# Altium schematic sheet STM32F405.SchDoc
size 317 x 241 mm
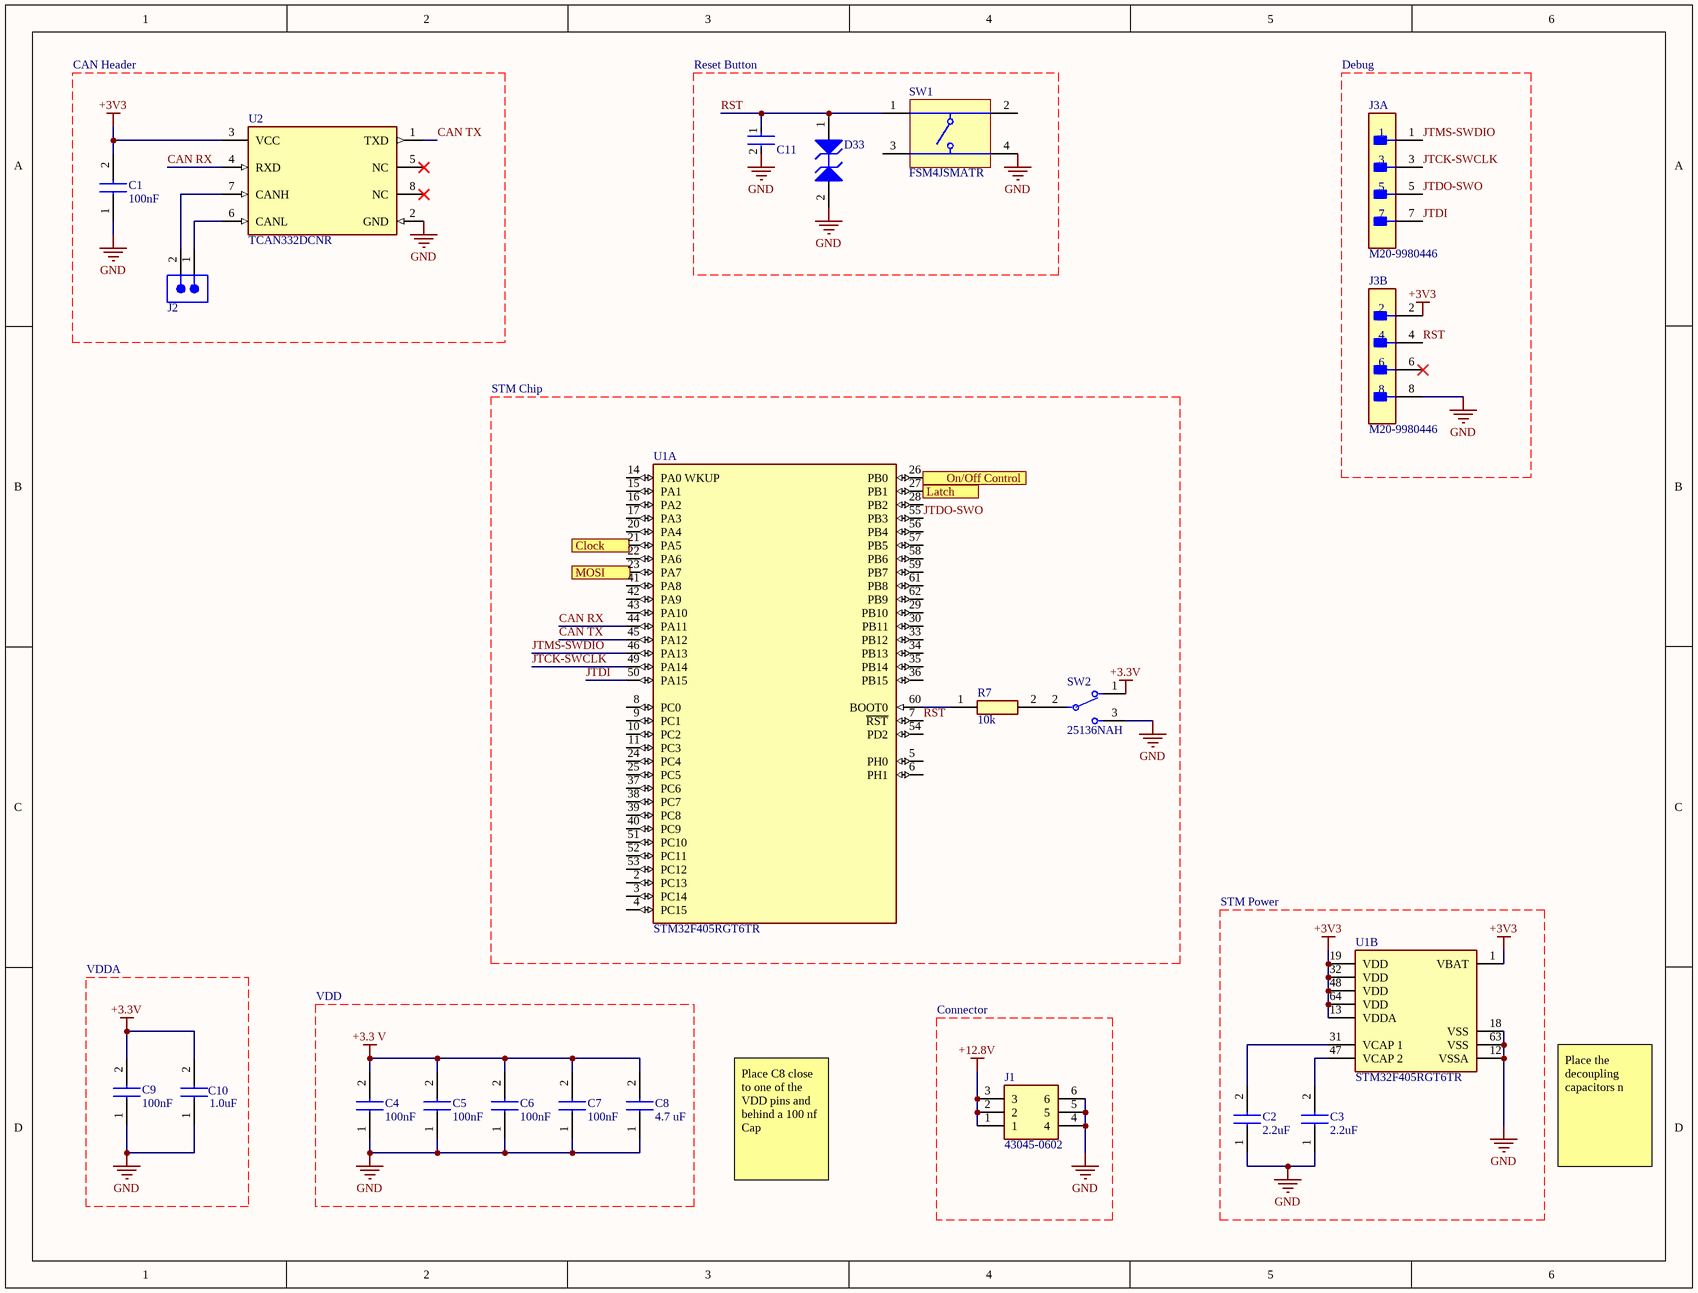
[diagram p0: STM32F405.SchDoc]

## Parts
C1  100nF  [C1206]
C2  2.2uF  [CAPC2012X145N]
C3  2.2uF  [CAPC2012X145N]
C4  100nF  [C1206]
C5  100nF  [C1206]
C6  100nF  [C1206]
C7  100nF  [C1206]
C8  4.7 uF  [C1210]
C9  100nF  [CAPC3216X95N]
C10  1.0uF  [C0805]
C11  100 nF  [FP-CL31-IPC_C]  (value not drawn)
D33  ESD5B5.0ST1G  [ONSC-SOD-523-2-502-01_C_V]  (value not drawn)
J1  43045-0602  [43045-06(00,01,02,10)]
J2  679302124022  [679302124022]  (value not drawn)
J3  M20-9980446  [FP-M20-9980446-MFG]  (parts A,B of 2)
R7  10k  [RESC3016X65N]
SW1  FSM4JSMATR  [TECO-FSM4JSMATR_V]
SW2  25136NAH  [FP-25136NAH-MFG]
U1  STM32F405RGT6TR  [FP-LQFP64-5W-IPC_C]  (parts A,B of 2)
U2  TCAN332DCNR  [FP-DCN0008A-IPC_A]

## Ports
Clock (out), Latch (out), MOSI (out), On/Off Control (out)

## Nets
+3.3 V: C4.2 C5.2 C6.2 C7.2 C8.2
+3.3V: C9.2 C10.2 SW2.1
+3V3: C1.2 J3.2 U1.1(VBAT) U1.13(VDDA) U1.19(VDD) U1.32(VDD) U1.48(VDD) U1.64(VDD) U2.3(VCC)
+12.8V: J1.1 J1.2 J1.3
GND: C1.1 C2.1 C3.1 C4.1 C5.1 C6.1 C7.1 C8.1 C9.1 C10.1 C11.2 D33.2(A2) J1.4 J1.5 J1.6 J3.8 SW1.4 SW2.3 U1.12(VSSA) U1.18(VSS) U1.63(VSS) U2.2(GND)
CAN RX: U1.44(PA11) U2.4(RXD)
CAN TX: U1.45(PA12) U2.1(TXD)
JTCK-SWCLK: J3.3 U1.49(PA14)
JTDI: J3.7 U1.50(PA15)
JTDO-SWO: J3.5 U1.55(PB3)
JTMS-SWDIO: J3.1 U1.46(PA13)
Latch: U1.27(PB1) ; port Latch
On/Off Control: U1.26(PB0) ; port On/Off Control
RST: C11.1 D33.1(A1) J3.4 SW1.1 U1.7(~{RST})
NetC2_2: C2.2 U1.31(VCAP_1)
NetC3_2: C3.2 U1.47(VCAP_2)
NetJ2_1: J2.1 U2.6(CANL)
NetJ2_2: J2.2 U2.7(CANH)
NetR7_1: R7.1 U1.60(BOOT0)
NetR7_2: R7.2 SW2.2

Not connected (* = marked no-connect by the designer): J3 6*; SW1 2 3; U1 2(PC13) 3(PC14) 4(PC15) 5(PH0) 6(PH1) 8(PC0) 9(PC1) 10(PC2) 11(PC3) 14(PA0_WKUP) 15(PA1) 16(PA2) 17(PA3) 20(PA4) 21(PA5) 22(PA6) 23(PA7) 24(PC4) 25(PC5) 28(PB2) 29(PB10) 30(PB11) 33(PB12) 34(PB13) 35(PB14) 36(PB15) 37(PC6) 38(PC7) 39(PC8) 40(PC9) 41(PA8) 42(PA9) 43(PA10) 51(PC10) 52(PC11) 53(PC12) 54(PD2) 56(PB4) 57(PB5) 58(PB6) 59(PB7) 61(PB8) 62(PB9); U2 5(NC)* 8(NC)*

## Notes on the sheet
- CAN Header
- Reset Button
- Debug
- STM Chip
- STM Power
- VDDA
- VDD
- Connector
- Place C8 close to one of the VDD pins and behind a 100 nf Cap
- Place the decoupling capacitors n

## Library data of the parts
C1 C4-C7 = C1206C104K5RACTU: Capacitor; Manufacturer_Name: KEMET; Datasheet Link: https://content.kemet.com/datasheets/KEM_C1002_X7R_SMD.pdf; Manufacturer_Part_Number: C1206C104K5RACTU; Mouser Part Number: 80-C1206C104K5R; Mouser Price/Stock: https://www.mouser.co.uk/ProductDetail/KEMET/C1206C104K5RACTU?qs=VbFpUC1cecnmBMAUeCQCPw%3D%3D; Arrow Part Number: C1206C104K5RACTU; Arrow Price/Stock: https://www.arrow.com/en/products/c1206c104k5ractu/kemet-corporation?region=nac
C2 C3 = C2012X5R1V225K125AB: Capacitor; Manufacturer_Name: TDK; Datasheet Link: https://product.tdk.com/info/en/catalog/datasheets/mlcc_commercial_midvoltage_en.pdf; Height: 1.45mm; Manufacturer_Part_Number: C2012X5R1V225K125AB; Mouser Part Number: 810-C2012X5R1V225KAB; Mouser Price/Stock: https://www.mouser.co.uk/ProductDetail/TDK/C2012X5R1V225K125AB?qs=6JAMGB%252BEdkx9Qe2qZwx06Q%3D%3D; Arrow Part Number: C2012X5R1V225K125AB; Arrow Price/Stock: https://www.arrow.com/en/products/c2012x5r1v225k125ab/tdk
C8 = C1210C475K8RACTU: Capacitor; Manufacturer_Name: KEMET; Datasheet Link: https://content.kemet.com/datasheets/KEM_C1002_X7R_SMD.pdf; Manufacturer_Part_Number: C1210C475K8RACTU; Mouser Part Number: 80-C1210C475K8R; Mouser Price/Stock: https://www.mouser.co.uk/ProductDetail/KEMET/C1210C475K8RACTU?qs=oz8GmW2iRsteX%252BuxrlEukQ%3D%3D
C9 = CC1206KRX7R8BB104: Capacitor; Manufacturer_Name: YAGEO; Datasheet Link: https://4donline.ihs.com/images/VipMasterIC/IC/YAGO/YAGO-S-A0011723860/YAGO-S-A0011723860-1.pdf?hkey=6D3A4C79FDBF58556ACFDE234799DDF0; Height: 0.95mm; Manufacturer_Part_Number: CC1206KRX7R8BB104; Mouser Part Number: 603-CC206KRX7R8BB104; Mouser Price/Stock: https://www.mouser.co.uk/ProductDetail/YAGEO/CC1206KRX7R8BB104?qs=AgBp2OyFlx%2Fzdk9Exx7Hmw%3D%3D; Arrow Part Number: CC1206KRX7R8BB104; Arrow Price/Stock: https://www.arrow.com/en/products/cc1206krx7r8bb104/yageo?region=nac
C10 = C0805X105K3RACTU: Capacitor; Manufacturer_Name: KEMET; Datasheet Link: https://content.kemet.com/datasheets/KEM_C1013_X7R_FT-CAP_SMD.pdf; Height: 1.1mm; Manufacturer_Part_Number: C0805X105K3RACTU; Mouser Part Number: 80-C0805X105K3RACTU; Mouser Price/Stock: https://www.mouser.co.uk/ProductDetail/KEMET/C0805X105K3RACTU?qs=8Lo7A5hKj2SKGRiy4muzQg%3D%3D; Arrow Part Number: C0805X105K3RACTU; Arrow Price/Stock: https://www.arrow.com/en/products/c0805x105k3ractu/kemet-corporation?region=nac
C11 = CMP-13271-001835-1: Cap Ceramic 100nF 50V X7R ±10% SMD 1206 +125°C Embossed T/R; Capacitance: 100nF; Case Code (Metric): 3216; Case/Package: 1206; Ratings: AEC-Q200; Mount: Surface Mount; Tolerance: 10%; Voltage Rating: 50V; Packaging: Tape and Reel; Max Operating Temperature: 125°C; Min Operating Temperature: -55°C; Case Code (Imperial): 1206; Dielectric: X7R
D33 = CMP-1063-00096-1: Transient Voltage Suppressor, Micro-Packaged Diode for ESD Protection, 2-Pin SOD-523, Pb-Free, Tape and Reel; Manufacturer: On Semiconductor; Number of Lines: 1; Direction: Bidirectional; VRWM Max (V): 5; V(BR) Min (V): 5.8; ComponentLink2URL: http://www.onsemi.cn/pub_link/Collateral/ESD5B5.0ST1G.PDF; Mounting Technology: Surface Mount; ComponentLink1URL: http://www.onsemi.com/; ComponentLink2Description: Datasheet; ComponentLink3Description: Package Specification; RoHS: Pb-Free; Packing: Tape and Reel; PackageDescription: 2-Pin SOD, Body 1.2 x 0.8 mm; ComponentLink1Description: Manufacturer URL; ComponentLink3URL: http://www.onsemi.cn/pub_link/Collateral/ESD5B5.0ST1G.PDF; PackageVersion: Rev. C, 03/2007; DatasheetVersion: Rev. 3; PartNumber: ESD5B5.0ST1G; PackageReference: SOD-523-2-502-01_C; IR Max (uA): 1
J1 = 43045-0602: Connector; Manufacturer_Name: Molex; Datasheet Link: https://www.molex.com/pdm_docs/sd/430450200_sd.pdf; Height: 9.9mm; Manufacturer_Part_Number: 43045-0602; Mouser Part Number: 538-43045-0602; Mouser Price/Stock: https://www.mouser.co.uk/ProductDetail/Molex/43045-0602?qs=mrPiglD9aYLv9OehwOZTng%3D%3D
J2 = CMP-1502-00721-2: NexarPartId: 18818281; Number of Positions: 2; Connector Type: Male Pin; Contact Resistance: 20mΩ; Operating Supply Voltage: 50V; Insulation: Insulated; Gender: Male; Pitch: 1.5mm; Insulation Resistance: 100MΩ; Current Rating: 1A; Flammability Rating: UL94 V-0; Contact Gender: Male; Orientation: Vertical; Color: Beige, White; Termination: SMD/SMT; Length: 6mm; Width: 6mm; Packaging: Tape and Reel; Contact Material: Copper; Contact Plating: Tin; Mount: Surface Mount; Max Operating Temperature: 85°C; Number of Pins: 2; Voltage Rating: 50V; Housing Material: Nylon; Number of Contacts: 2; Number of Rows: 1; Height: 5mm; Lead Pitch: 1.5mm; REACH SVHC: Unknown; RoHS: Compliant; Min Operating Temperature: -25°C
J3 = CMP-15831-000088-1: CONN HEADER VERT 8POS 2.54MM; Row Spacing: 0.1inch; Current Rating: 3A; Mated Stacking Heights: 16.54mm; Insulation Resistance: 10GR; Connector Type: Male Pin; Gender: Male; Number of Contacts: 8; Contact Resistance: 30mR; Contact Material: Brass; Series: M20; Max Operating Temperature: 105°C; REACH SVHC: No SVHC; Flammability Rating: UL94 V-0; Number of Rows: 2; Mount: Through Hole; Contact Plating: Tin; Min Operating Temperature: -40°C; Packaging: Bulk; Radiation Hardening: No; Insulation Material: Nylon; Orientation: Straight; Contact Shape: Square; Max Current Rating: 3A; Contact Type: Male Pin; Depth: 5.08mm; Color: Black; Contact Finish - Mating: TIN; Length: 10.16mm; Housing Color: Black; Package Quantity: 1000; Pitch: 2.54mm; Contact Mating Length: 0.24inch; Termination: Solder; Housing Material: Nylon; Fastening Type: Pull; Insulation Color: Black; Number of Positions: 8; RoHS Compliant: Yes
R7 = RP73D2B10KBTDF: Resistor; Manufacturer_Name: TE Connectivity; Datasheet Link: https://www.te.com/commerce/DocumentDelivery/DDEController?Action=srchrtrv&DocNm=8-1773459-4_ELEVATOR_ESCALATOR_SOLUTIONS&DocType=Data%20Sheet&DocLang=English&PartCntxt=6-1879261-8&DocFormat=pdf; Height: 0.65mm; Manufacturer_Part_Number: RP73D2B10KBTDF; Mouser Part Number: 279-RP73D2B10KBTDF; Mouser Price/Stock: https://www.mouser.co.uk/ProductDetail/TE-Connectivity-Holsworthy/RP73D2B10KBTDF?qs=8G8kQhBkhGisIrE0IZvSPA%3D%3D; Arrow Part Number: RP73D2B10KBTDF; Arrow Price/Stock: https://www.arrow.com/en/products/rp73d2b10kbtdf/te-connectivity?region=nac
SW1 = CMP-2000-07486-1: Micro Miniature Push Button Switch FSM JSM, 50 mA, -35 to 85 degC, 4-Pin SMD, RoHS, Tape and Reel; Manufacturer: TE Connectivity; Mechanical Life: 100000Cycles; Current Rating: 50mA; Actuator Material: Polyamide; Max Voltage Rating (DC): 12V; Capacitance: 0f; Illumination Type: Illuminated; Voltage Rating (DC): 24V; Case\/Package: SMD/SMT; Operating Force: 160gf; Contact Resistance: 100mOhm; Actuator Length: 0.055inch; Switch Travel: 0.25mm; Throw Configuration: SPST; Termination: GullWing; Contact Plating: Silver; Orientation: Straight; Mounting Technology: SurfaceMount; REACH SVHC: Unknown; Electrical Life: 100000Cycles; Package Reference: FSM4JSMATR; Max Operating Temperature: 85degC; Manufacturer URL: http://www.te.com/; Package Description: 4-Pin Surface Mount Device, Body 6 x 6 mm, Pitch 4.5 mm; Datasheet Version: Rev. V, 02/2015; Packaging: TapeandReel; Min Operating Temperature: -35degC; Mount: SurfaceMount; Contact Current Rating: 50mA; Contact Material: CopperAlloy; Package Quantity: 1200; Datasheet URL: http://www.te.com/commerce/DocumentDelivery/DDEController?Action=showdoc&DocId=Customer+Drawing%7F2-1437565-7%7FV%7Fpdf%7FEnglish%7FENG_CD_2-1437565-7_V.pdf%7F4-1437565-2; RoHSCompliant: true
SW2 = CMP-47022-000001-1: SWITCH SLIDE SPDT 4A 125V; Actuator Material: Nylon; Max Current Rating: 1A; Electrical Life: 10000Cycles; Mechanical Life: 20000Cycles; Actuator Length: 2.8mm; Switch Function: On-On; Switch Travel: 4mm; Illumination Type: Non-Illuminated; Max Voltage Rating (AC): 250V; Insulation Resistance: 1GR; Actuator Type: Standard; Max Voltage Rating (DC): 30V; Contact Resistance: 10mR; Contact Plating: Silver; Mount: Through Hole; Voltage Rating (AC): 125V; Min Operating Temperature: -40°C; Contact Current Rating: 4A; Orientation: Vertical; Termination: PC Pins; Current Rating: 1A; Depth: 7.5mm; Max Operating Temperature: 85°C; Package Quantity: 100; Throw Configuration: SPDT; Contact Material: Silver; REACH SVHC: No SVHC; Packaging: Bulk; Voltage Rating (DC): 30V; Length: 14.1mm
U1 = CMP-0243-00156-2: IC MCU 32BIT 1MB FLASH 64LQFP; Frequency: 168MHz; Number of SPI Channels: 3; Oscillator Type: Internal; Core Architecture: ARM; Number of UART Channels: 2; Max Supply Voltage: 3.6V; Watchdog Timer: Yes; RAM Size: 196KB; Interface: I2C; Max Power Dissipation: 435mW; Number of Timers/Counters: 14; Data Bus Width: 32b; Peripherals: Brown-out Detect/Reset; Number of ADC Channels: 16; Min Supply Voltage: 1.8V; Number of Programmable I/O: 51; Memory Size: 1024KB; Max Operating Temperature: 85°C; Package Quantity: 1000; Lead Free: Lead Free; Memory Type: FLASH; Case/Package: LQFP; Number of I2C Channels: 3; Contact Plating: Tin; Mount: Surface Mount; Min Operating Temperature: -40°C; Radiation Hardening: No; Number of USB Channels: 2; Packaging: Tape and Reel; Height: 1.45mm; Number of Pins: 64; Number of I/Os: 51; Max Frequency: 168MHz; Width: 10mm; Length: 10mm
U2 = CMP-04872-000203-1: IC TRANSCEIVER 1/1 SOT23-8; Receiver Hysteresis: 120mV; Packaging: Tape and Reel; Mount: Surface Mount; RoHS Compliant: Yes; Min Operating Temperature: -40°C; Case/Package: SOT-23-8; Lead Free: Lead Free; Max Operating Temperature: 125°C